# Altium schematic sheet Sheet3.SchDoc
size A4; SheetNumber: 3; SheetTotal: 3
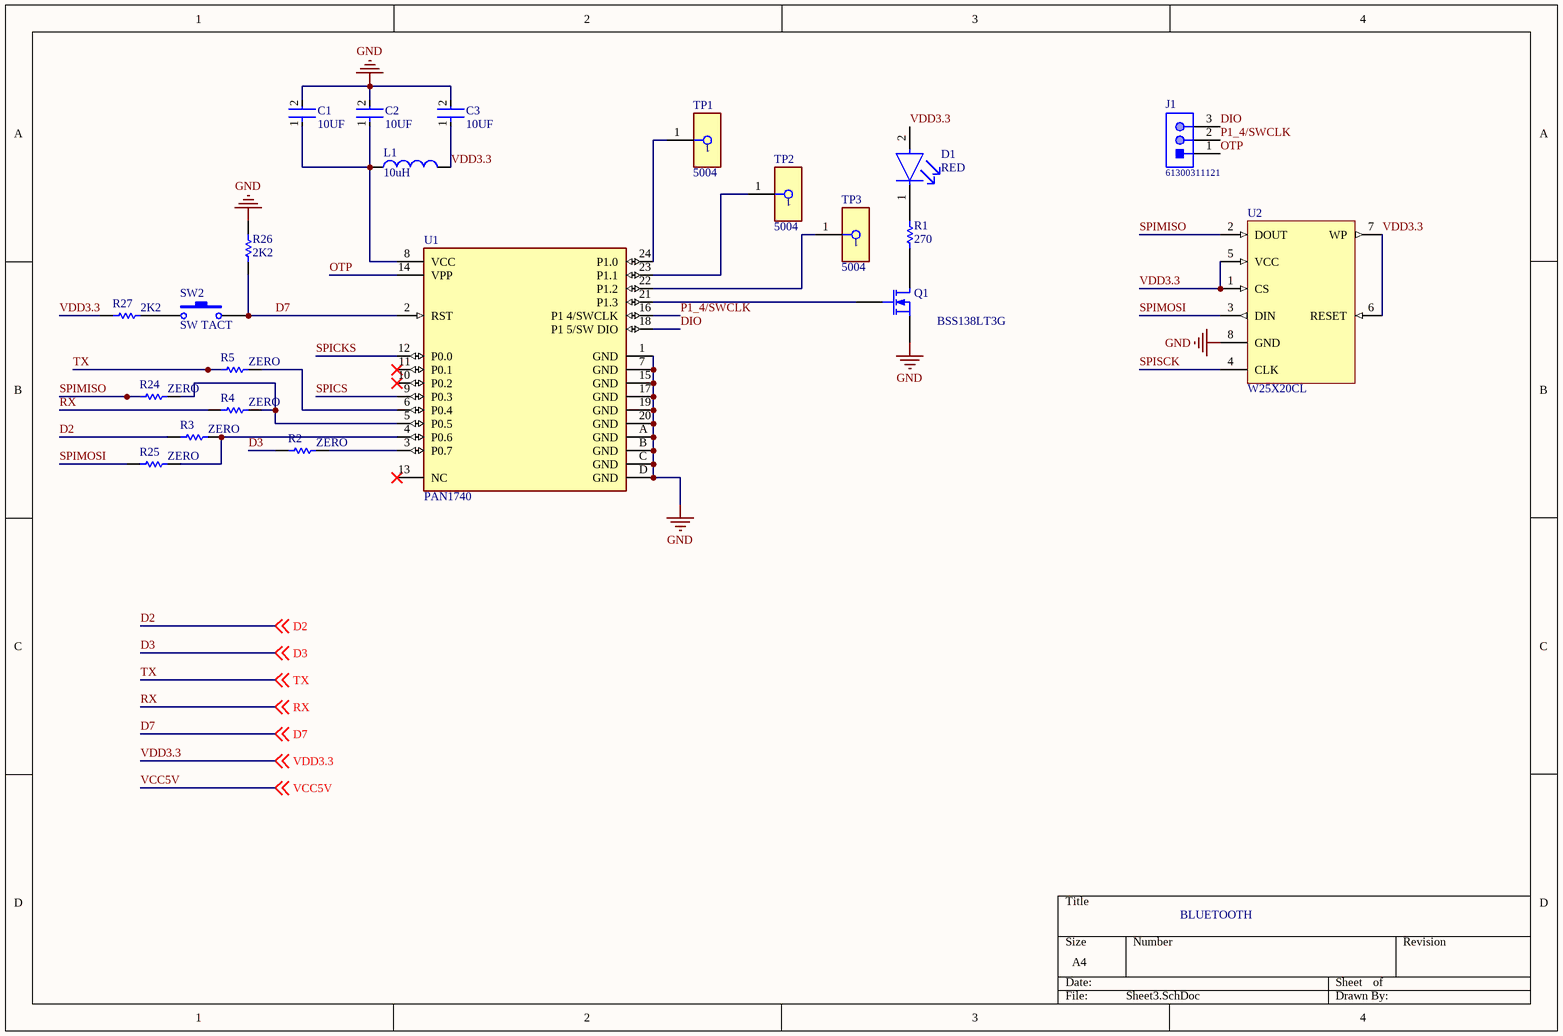
[diagram p0: Sheet3.SchDoc]

## Parts
C1  10UF  [FP-C0805C-DN-MFG]
C2  10UF  [FP-C0805C-DN-MFG]
C3  10UF  [FP-C0805C-DN-MFG]
D1  RED  [FP-LTST-C190GKT-MFG]
J1  61300311121  [61300311121]
L1  value 10uH  [0402-A]  (hidden comment: Inductor)
Q1  BSS138LT3G  [E3]
R1  270  [RESC1005X40X25NL05T10]
R2  ZERO  [RESC1005X40X25NL05T10]
R3  ZERO  [RESC1005X40X25NL05T10]
R4  ZERO  [RESC1005X40X25NL05T10]
R5  ZERO  [RESC1005X40X25NL05T10]
R24  ZERO  [RESC1005X40X25NL05T10]
R25  ZERO  [RESC1005X40X25NL05T10]
R26  2K2  [RESC1005X40X25NL05T10]
R27  2K2  [RESC1005X40X25NL05T10]
SW2  SW TACT  [SPST-2]
TP1  5004  [FP-5004-MFG]
TP2  5004  [FP-5004-MFG]
TP3  5004  [FP-5004-MFG]
U1  PAN1740  [FP-ENW-89846A1KF-MFG]
U2  W25X20CL  [PDIP300-P8]

## Nets
GND: C1.2 C2.2 C3.2 Q1.3(S) R26.2 U1.1(GND) U1.7(GND) U1.15(GND) U1.17(GND) U1.19(GND) U1.20(GND) U1.A(GND) U1.B(GND) U1.C(GND) U1.D(GND) U2.8(GND)
D2: R3.1 ; off-sheet D2
D3: R2.1 ; off-sheet D3
D7: R26.1 SW2.2 U1.2(RST) ; off-sheet D7
DIO: J1.3 U1.18(P1_5/SW_DIO)
OTP: J1.1 U1.14(VPP)
P1_4/SWCLK: J1.2 U1.16(P1_4/SWCLK)
RX: R4.1 ; off-sheet RX
SPICKS: U1.12(P0.0)
SPICS: U1.9(P0.3)
SPIMISO: R24.1 U2.2(DOUT)
SPIMOSI: R25.1 U2.3(DIN)
SPISCK: U2.4(CLK)
TX: R5.1 ; off-sheet TX
VDD3.3: C3.1 D1.2(A) L1.2 R27.1 U2.1(CS) U2.5(VCC) U2.6(RESET) U2.7(WP) ; off-sheet VDD3.3
NetC1_1: C1.1 C2.1 L1.1 U1.8(VCC)
NetD1_1: D1.1(C) R1.2
NetQ1_1: Q1.1(D) R1.1
NetQ1_2: Q1.2(G) U1.21(P1.3)
NetR2_2: R2.2 U1.3(P0.7)
NetR3_2: R3.2 R25.2 U1.4(P0.6)
NetR4_2: R4.2 R24.2 U1.5(P0.5)
NetR5_2: R5.2 U1.6(P0.4)
NetR27_2: R27.2 SW2.1
NetTP1_1: TP1.1 U1.24(P1.0)
NetTP2_1: TP2.1 U1.23(P1.1)
NetTP3_1: TP3.1 U1.22(P1.2)

Not connected (* = marked no-connect by the designer): U1 10(P0.2)* 11(P0.1)* 13(NC)*

## Notes on the sheet
- BLUETOOTH

## Library data of the parts
C1-C3 = CMP-2007-00279-2: CAP CER 0.1UF 50V X7R 0805; Manufacturer Part Number: C0805C104K5RACTU; Manufacturer: KEMET; Value: 0.10 μF; Tolerance: 0.1; Temperature Coefficient: 30ppm/°C; Material: Ceramic; Device Class L2: Capacitors; Temperature Range Low: -55°C; Voltage Rating: 50 V; Digikey Description: CAP CER 0.1UF 50V X7R 0805; Category: Cap; ComponentLink2Description: Datasheet; Octopart: https://octopart.com/c0805c104k5ractu-kemet-143926; RoHS: TRUE; ComponentLink2URL: https://content.kemet.com/datasheets/KEM_C1003_C0G_SMD.pdf; Temperature Characteristic: X7R; Temperature: -55°C to +125°C; Height: 0.88mm; Temperature Range High: +125°C; Device Class L1: Passive Components; Automotive: No; Lead Free: Yes; Ipc Land Pattern Name: CAPC200125X78; Device Class L3: Ceramic Capacitors; Mouser Description: Cap Ceramic 0.1uF 50V X7R 10% SMD 2.0 x 1.2 mm 125 C Paper T/R; Capacitance: 0.10 μF; Package: C0805C-DN
D1 = CMP-22017-000005-2: LED GREEN CLEAR CHIP SMD; Dominant Wavelength: 569nm; Reverse Voltage: 5V; Lens Color: Colorless; Viewing Angle: 130°; Voltage: 2V; Forward Current: 30mA; Power Dissipation: 100mW; Luminous Intensity: 6mcd; Number of LEDs: 1; Forward Voltage: 2.1V; Wavelength: 565nm; Test Current: 10mA; Min Operating Temperature: -55°C; Lens Style: Clear; Mount: Surface Mount; Width: 0.8mm; Packaging: Tape and Reel; Lens Transparency: Clear; Case Code (Metric): 1608; Depth: 0.8mm; Case Code (Imperial): 0603; Case/Package: 0603; Number of Pins: 2; Max Operating Temperature: 85°C; Lead Free: Lead Free; Number of Elements: 1; Length: 1.6mm; Height: 0.8mm; Package Quantity: 1; Power Rating: 100mW; Radiation Hardening: No; Illumination Color: Green; Color: Green
J1 = CMP-1502-01062-1: THT Vertical Pin Header WR-PHD, Pitch 2.54 mm, Single Row, 3 pins; Manufacturer: Wurth Elektronik; Withstanding Voltage: 500VAC; Working Voltage: 250VAC; Rated Current: 3A; Pitch: 2.54mm; Pin Number: 3; Gender: Male; Contact Resistance: 20mOhm; Package Reference: 61300311121; Manufacturer URL: http://www.we-online.de; Datasheet URL: https://katalog.we-online.de/em/datasheet/6130xx11121.pdf; Operating Temperature: -40to105degC; Part Number: 61300311121; Orientation: Vertical; Packaging: Bag; Row Number: Single; Mounting Technology: THT; Publisher: WurthElektronik
L1 = Inductor: Code_IEC: 1005; Published: 8-Jun-2000; LatestRevisionDate: 29-May-2009; LatestRevisionNote: IPC-7351 Footprint Added.; PackageReference: 0402-A; Publisher: Altium Limited; PackageDescription: Chip Inductor; Code_JEITA: 0402
Q1 = MOSFET-N: N-Channel MOSFET; Published: 8-Jun-2000; LatestRevisionDate: 17-Jul-2002; LatestRevisionNote: Re-released for DXP Platform.; PackageVersion: 1995/1996; PackageReference: E3; Publisher: Altium Limited; PackageDescription: TO, Flat Index; 3 In-Line, Axial Leads; Body Dia. 4.6mm; Lead Dia. 0.5 mm (max)
R1-R5 R24-R27 = CMP-1011-00001-2: Manufacturer: Yageo / Phycomp; Part Number: RC0402JR-070RL
SW2 = SW-PB: Switch; Published: 24-Mar-1999; LatestRevisionDate: 17-Jul-2002; LatestRevisionNote: Re-released for DXP Platform.; PackageReference: SPST-2; Publisher: Altium Limited; PackageDescription: Switch; 2 Leads
TP1-TP3 = CMP-2000-05575-2: PC TEST POINT MINIATURE YELLOW; Manufacturer: Keystone; Number Of Contacts: 1; Is Female: yes; Device Class L1: Connectors; Manufacturer Part Number: 5004; Digikey Description: PC TEST POINT MINIATURE YELLOW; ComponentLink2URL: https://www.keyelco.com/product-pdf.cfm?p=1313; Lead Free: Yes; ComponentLink2Description: Datasheet; Category: Conn; Height: 4.72mm; Octopart: https://octopart.com/5004-keystone-28591; Mouser Description: TEST POINT PC MINI .040"D YELLOW; Device Class L3: unset; Contact Material: Silver; Package: 5004; Automotive: No; Device Class L2: unset; RoHS: TRUE
U1 = CMP-05527-000002-1: RF TXRX MOD BLUETOOTH CHIP ANT; Manufacturer: Panasonic; Manufacturer Part Number: ENW-89846A1KF; Number Of Gpio: 14; Number Of Adc Channels: 4; Max Frequency: 2.4GHz; Interface: I2C,SPI,UART; Sensitivity: -93dBm; Receiving Current: 4.9mA; Max Supply Voltage: 3.3V; Data Rate: 1Mbits/s; Min Supply Voltage: 2.35V; Temperature Range High: +85°C; Category: UNK; ComponentLink2Description: Datasheet; Temperature Range Low: -40°C; Lead Free: Yes; ComponentLink2URL: https://b2b-api.panasonic.eu/file_stream/pids/fileversion/4534; Digikey Description: RF TXRX MOD BLUETOOTH CHIP ANT; Ambient Temperature Range Low: -40°C; Device Class L2: RF Semiconductors and Devices; Ambient Temperature Range High: +85°C; Device Class L3: Transceivers; Height: 2mm; Package: 0; Automotive: No; Transmitting Current: 4.9mA; Temperature: -40°C to +85°C; Device Class L1: Integrated Circuits (ICs); Octopart: https://octopart.com/enw-89846a1kf-panasonic-38566823; RoHS: TRUE
U2 = CMP-0186-00092-2: Infrared Encoder/Decoder, PDIP, Extended Temperature; DatasheetVersion: revC, Feb-2007; ComponentLink2Description: Datasheet; ComponentLink2URL: http://ww1.microchip.com/downloads/en/DeviceDoc/21894c.pdf; ComponentLink1Description: Manufacturer URL; PackageVersion: revBB, Aug-2009; Code_JEDEC: MS-001; ComponentLink3Description: Package Specification; PackageReference: PDIP300-P8; RevisionNote: URLs added.; PackageDescription: 8-Lead Plastic Dual In-Line (P) - 300 mil Body [PDIP]; ComponentLink1URL: http://www.microchip.com/; ComponentLink3URL: http://www.microchip.com/stellent/groups/techpub_sg/documents/packagingspec/en012702.pdf